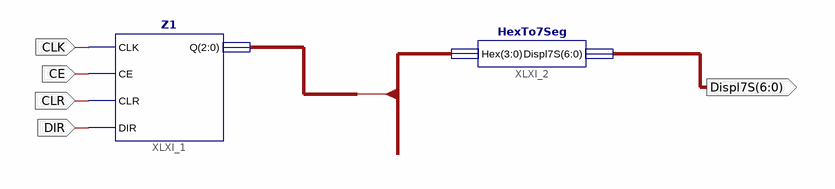
[diagram p0: schematic sheet 1]
// Xilinx ISE schematic Z2.sch (xc9500xl) as structural Verilog: 2 symbols, 5 ports
module Z2 (
  input  CLK,
  input  CE,
  input  CLR,
  input  DIR,
  output [6:0] Displ7S
);

  wire [3:0] Hex;

  Z1 XLXI_1 (.CLK(CLK), .CE(CE), .CLR(CLR), .DIR(DIR), .Q(Hex[2:0]));
  HexTo7Seg XLXI_2 (.Hex(Hex), .Displ7S(Displ7S));
endmodule
